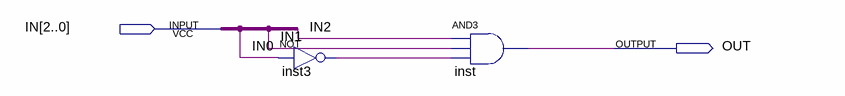
[diagram p0: schematic sheet]
// Quartus schematic Moore_Decode.bdf as structural Verilog: 2 symbols, 2 pins
module Moore_Decode (
  input  [2:0] IN,
  output OUT
);

  wire inst3_out;

  not inst3 (inst3_out, IN[0]);
  and inst (OUT, IN[2], IN[1], inst3_out);
endmodule
